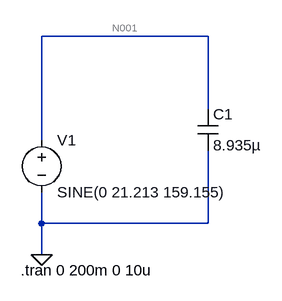
[diagram p0: schematic Сзема2.asc]
Сзема2.asc, the LTspice schematic file:
Version 4
SHEET 1 880 680
WIRE -1136 64 -1392 64
WIRE -1136 176 -1136 64
WIRE -1392 224 -1392 64
WIRE -1392 352 -1392 304
WIRE -1136 352 -1136 240
WIRE -1136 352 -1392 352
WIRE -1392 400 -1392 352
FLAG -1392 400 0
SYMBOL voltage -1392 208 R0
WINDOW 123 0 0 Left 0
WINDOW 39 0 0 Left 0
SYMATTR InstName V1
SYMATTR Value SINE(0 21.213 159.155)
SYMBOL cap -1152 176 R0
SYMATTR InstName C1
SYMATTR Value 8.935µ
TEXT -1424 424 Left 2 !.tran 0 200m 0 10u

The netlist it stands for:
* Сзема2.asc
V1 N001 0 SINE(0 21.213 159.155)
C1 N001 0 8.935µ
.tran 0 200m 0 10u
.backanno
.end

* Results of the author's LTspice run, read from the files saved beside the schematic
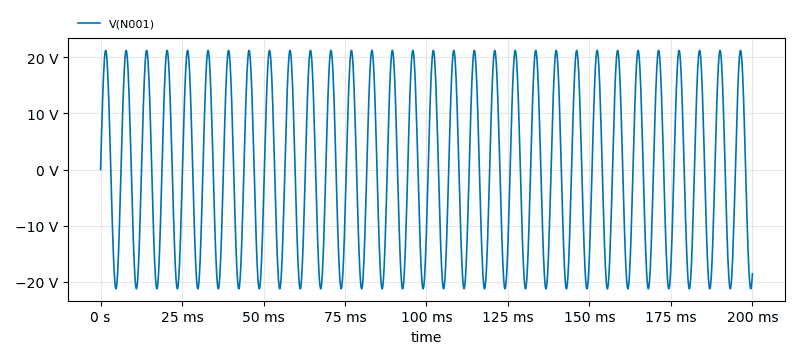
[diagram p1: Transient Analysis of Сзема2.asc, plotted from the saved traces]
* Transient Analysis, 1 run:
*   V(N001): min -21.21 V, max 21.21 V, average 54.11 mV, rms 15.02 V, last -18.52 V